# EasyEDA schematic SCH_Stimulus-FSR402-RPF602_2026-07-22.json
TITLE: Stimulus: Arduino UNO R3/R4; REV: 1.0; Date: 2026-07-22; Sheet: 1/1; Drawn By: alexpeeters; Company: GroeiAcademie
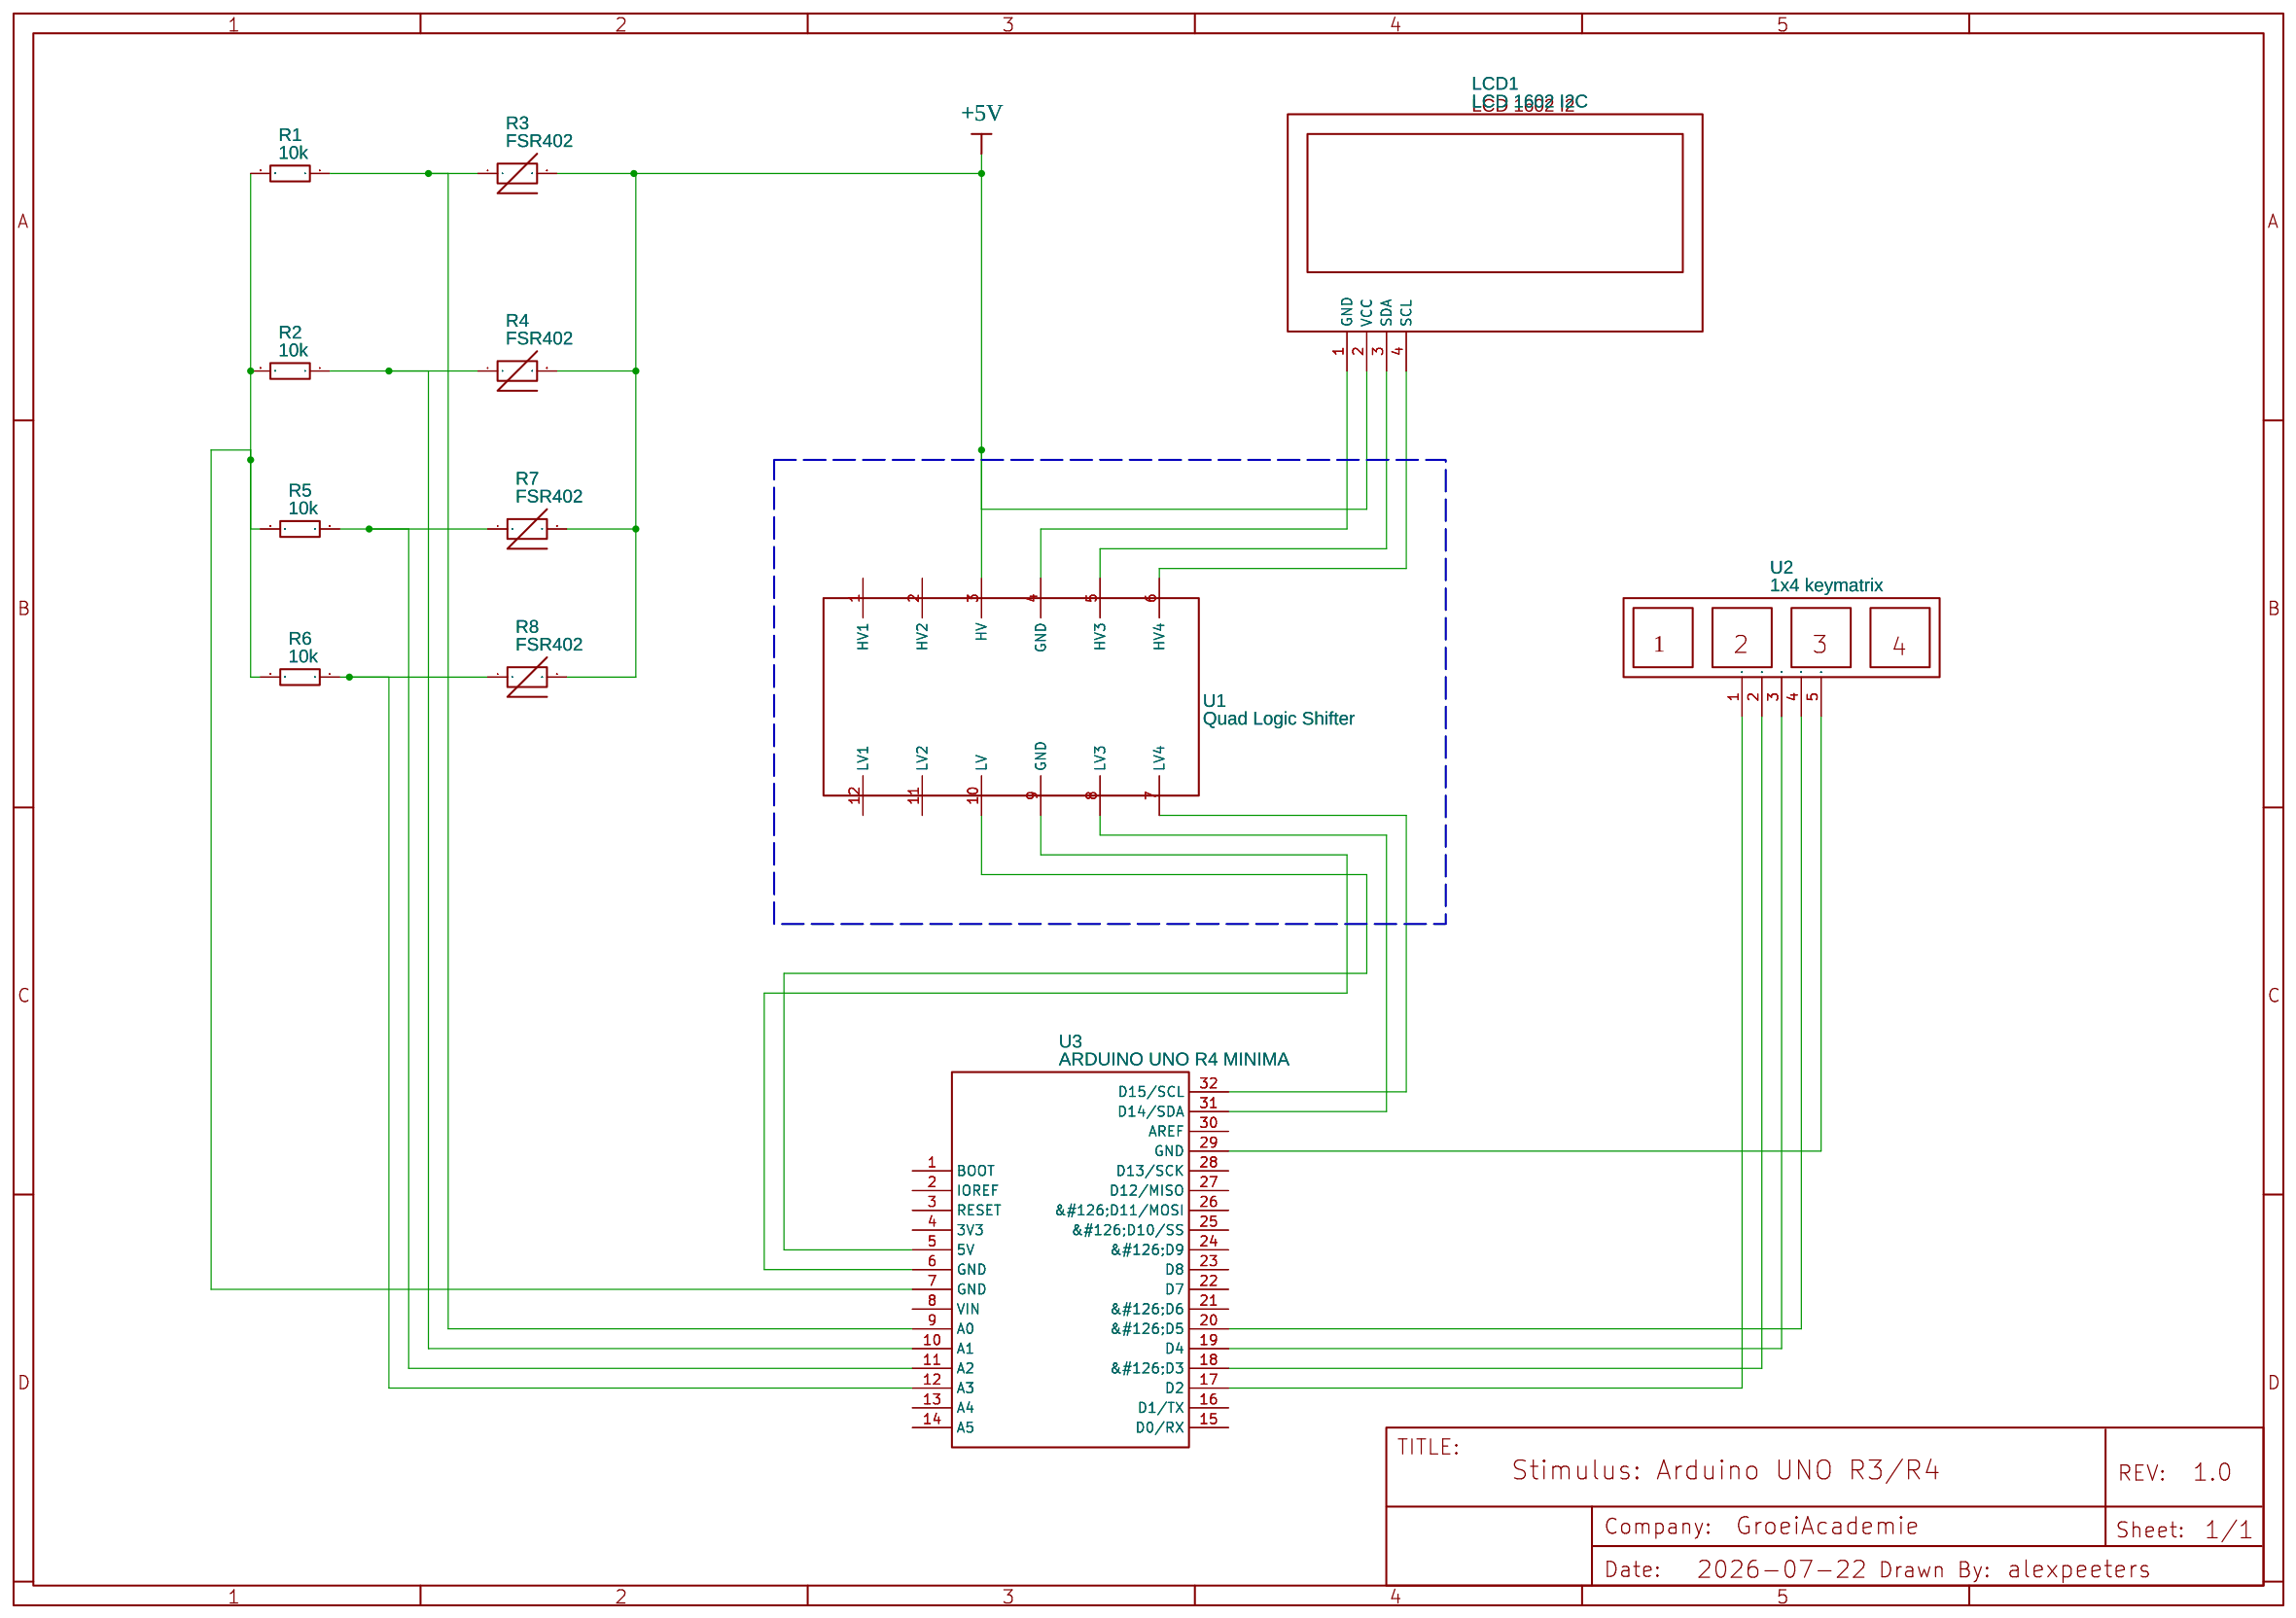
[diagram p0: schematic sheet]

## Parts
LCD1  LCD 1602 I2C  [I2CLCD16X2_N]
R1  10k  [WEERSTAND _P 10MM]
R2  10k  [WEERSTAND _P 10MM]
R3  FSR402  [FSR400]
R4  FSR402  [FSR400]
R5  10k  [WEERSTAND _P 10MM]
R6  10k  [WEERSTAND _P 10MM]
R7  FSR402  [FSR400]
R8  FSR402  [FSR400]
U1  Quad Logic Shifter  [LOGIC SHIFTER 4 CH]
U2  1x4 keymatrix  [KEYPAD1X4]
U3  ARDUINO UNO R4 MINIMA  [ARDUINO UNO R4 MINIMA]

## Library data of the parts
LCD1 = I2CLCD16X2_N: Contributor: abdenoura70
R1 R2 R5 R6 = 330Ω (331) ±5%: Supplier: LCSC; Supplier Part: C10322; Manufacturer: Made in China; Contributor: Oldman2019; JLCPCB Part Class: Extended Part
R3 R4 R7 R8 = FSR402-OPCION1: Contributor: N.Morisaki
U1 = Quad Logic Shifter: Contributor: wsarchibald1
U2 = Клавиатура 4*4: Contributor: oleg12062005; sourceId: AztLFXf9r
U3 = ARDUINO UNO R4 MINIMA: Contributor: qkrrhksgh33

## Nets
+5V: LCD1.2(VCC) R3.2 R4.2 R7.2 R8.2 U1.3(HV)
Net-(LCD1-1): LCD1.1(GND) U1.4(GND)
Net-(LCD1-3): LCD1.3(SDA) U1.5(HV3)
Net-(LCD1-4): LCD1.4(SCL) U1.6(HV4)
Net-(R1-1): R1.1 R3.1 U3.9(A0)
Net-(R1-2): R1.2 R2.2 R5.2 R6.2 U3.7(GND)
Net-(R2-1): R2.1 R4.1 U3.10(A1)
Net-(R5-1): R5.1 R7.1 U3.11(A2)
Net-(R6-1): R6.1 R8.1 U3.12(A3)
Net-(U1-7): U1.7(LV4) U3.32(D15/SCL)
Net-(U1-8): U1.8(LV3) U3.31(D14/SDA)
Net-(U1-9): U1.9(GND) U3.6(GND)
Net-(U1-10): U1.10(LV) U3.5(5V)
Net-(U2-1): U2.1(C1) U3.17(D2)
Net-(U2-2): U2.2(C2) U3.18(&#126;D3)
Net-(U2-3): U2.3(C3) U3.19(D4)
Net-(U2-4): U2.4(R1) U3.20(&#126;D5)
Net-(U2-5): U2.5(R2) U3.29(GND)

Not connected (* = marked no-connect by the designer): U1 1(HV1) 2(HV2) 11(LV2) 12(LV1); U3 1(BOOT) 2(IOREF) 3(RESET) 4(3V3) 8(VIN) 13(A4) 14(A5) 15(D0/RX) 16(D1/TX) 21(&#126;D6) 22(D7) 23(D8) 24(&#126;D9) 25(&#126;D10/SS) 26(&#126;D11/MOSI) 27(D12/MISO) 28(D13/SCK) 30(AREF)
